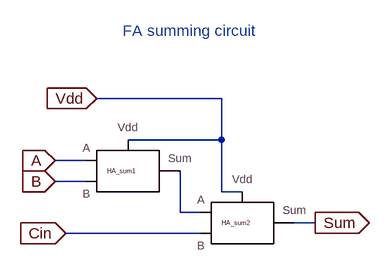
[diagram p0: schematic fa_sum.asc]
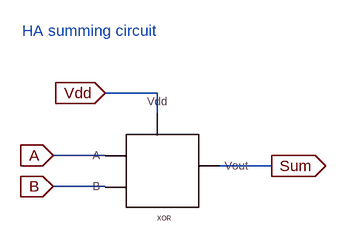
[diagram p1: sub-circuit ha_sum.asc]
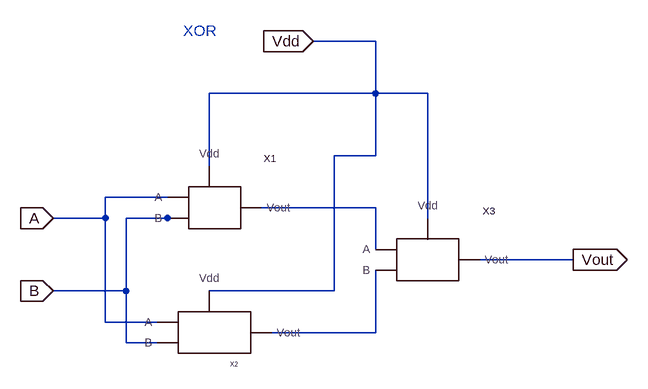
[diagram p2: sub-circuit my_xor.asc]
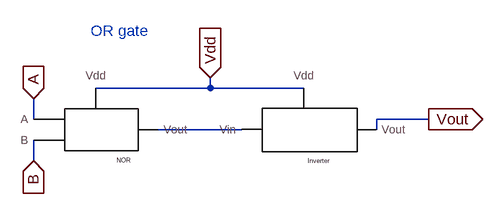
[diagram p3: sub-circuit my_or.asc]
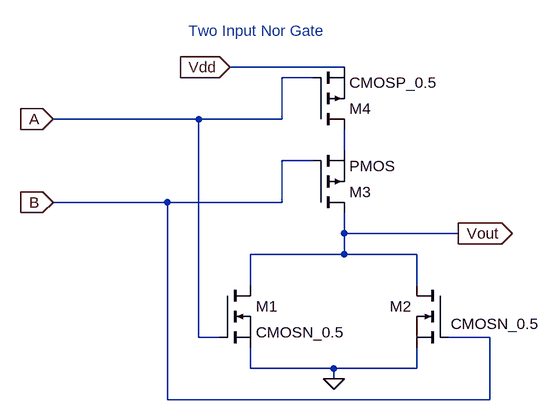
[diagram p4: sub-circuit my_nor.asc]
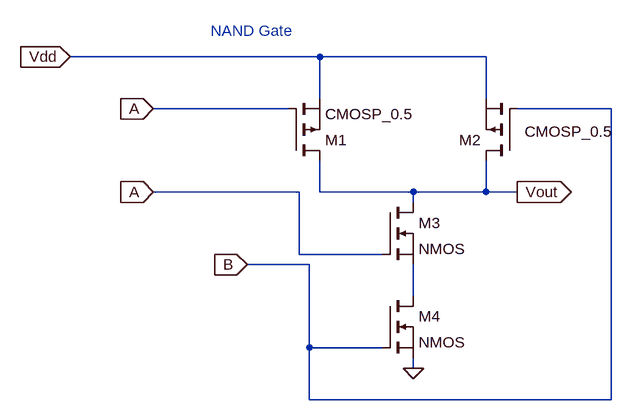
[diagram p5: sub-circuit my_nand.asc]
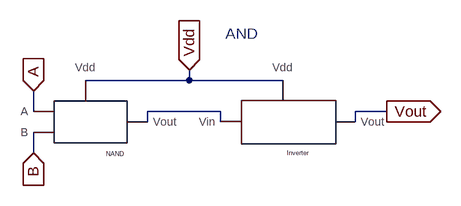
[diagram p6: sub-circuit my_and.asc]
fa_sum.asc, the LTspice schematic file:
Version 4
SHEET 1 880 680
WIRE 320 32 128 32
WIRE 320 96 320 32
WIRE 320 96 176 96
WIRE 112 128 64 128
WIRE 112 160 64 160
WIRE 320 176 320 96
WIRE 352 176 320 176
WIRE 256 208 256 144
WIRE 288 208 256 208
WIRE 464 224 432 224
WIRE 288 240 80 240
FLAG 64 128 A
IOPIN 64 128 In
FLAG 64 160 B
IOPIN 64 160 In
FLAG 80 240 Cin
IOPIN 80 240 In
FLAG 464 224 Sum
IOPIN 464 224 Out
FLAG 128 32 Vdd
IOPIN 128 32 In
SYMBOL ha_sum 176 144 R0
SYMATTR InstName HA_sum1
SYMBOL ha_sum 352 224 R0
SYMATTR InstName HA_sum2
TEXT 168 -72 Left 2 ;FA summing circuit

ha_sum.asc, the sub-circuit schematic file:
Version 4
SHEET 1 880 680
WIRE 208 0 128 0
WIRE 208 32 208 0
WIRE 128 96 48 96
WIRE 384 112 304 112
WIRE 128 144 48 144
FLAG 48 96 A
IOPIN 48 96 In
FLAG 48 144 B
IOPIN 48 144 In
FLAG 128 0 Vdd
IOPIN 128 0 In
FLAG 384 112 Sum
IOPIN 384 112 Out
SYMBOL my_xor 208 112 R0
SYMATTR InstName XOR
TEXT 0 -96 Left 2 ;HA summing circuit

my_xor.asc, the sub-circuit schematic file:
Version 4
SHEET 1 1232 680
WIRE 592 -160 496 -160
WIRE 592 -80 592 -160
WIRE 592 -80 336 -80
WIRE 672 -80 592 -80
WIRE 592 16 592 -80
WIRE 592 16 528 16
WIRE 336 32 336 -80
WIRE 272 80 176 80
WIRE 592 96 416 96
WIRE 176 112 176 80
WIRE 176 112 96 112
WIRE 272 112 208 112
WIRE 288 112 272 112
WIRE 672 112 672 -80
WIRE 592 160 592 96
WIRE 896 176 752 176
WIRE 208 224 208 112
WIRE 208 224 96 224
WIRE 528 224 528 16
WIRE 528 224 336 224
WIRE 176 272 176 112
WIRE 256 272 176 272
WIRE 592 288 592 192
WIRE 592 288 432 288
WIRE 208 304 208 224
WIRE 256 304 208 304
FLAG 96 112 A
IOPIN 96 112 In
FLAG 96 224 B
IOPIN 96 224 In
FLAG 496 -160 Vdd
IOPIN 496 -160 In
FLAG 896 176 Vout
IOPIN 896 176 Out
SYMBOL my_or 336 80 R0
SYMATTR InstName X1
SYMBOL my_nand 336 288 R0
SYMATTR InstName X2
SYMBOL my_and 672 176 R0
SYMATTR InstName X3
TEXT 296 -176 Left 2 ;XOR

my_or.asc, the sub-circuit schematic file:
Version 4
SHEET 1 880 680
WIRE 288 144 288 128
WIRE 288 144 112 144
WIRE 432 144 288 144
WIRE 16 192 16 160
WIRE 624 192 544 192
WIRE 336 208 208 208
WIRE 544 208 544 192
WIRE 16 256 16 224
FLAG 16 160 A
IOPIN 16 160 In
FLAG 16 256 B
IOPIN 16 256 In
FLAG 288 128 Vdd
IOPIN 288 128 In
FLAG 624 192 Vout
IOPIN 624 192 Out
SYMBOL my_nor 112 208 R0
SYMATTR InstName NOR
SYMBOL my_inverter 432 208 R0
SYMATTR InstName Inverter
TEXT 104 56 Left 2 ;OR gate

my_nor.asc, the sub-circuit schematic file:
Version 4
SHEET 1 880 680
WIRE 336 -240 160 -240
WIRE 288 -224 240 -224
WIRE 112 -160 -112 -160
WIRE 240 -160 240 -224
WIRE 240 -160 112 -160
WIRE 336 -112 336 -144
WIRE 288 -96 240 -96
WIRE 64 -32 -112 -32
WIRE 240 -32 240 -96
WIRE 240 -32 64 -32
WIRE 336 16 336 -16
WIRE 512 16 336 16
WIRE 336 48 336 16
WIRE 336 48 192 48
WIRE 448 48 336 48
WIRE 192 96 192 48
WIRE 448 96 448 48
WIRE 112 176 112 -160
WIRE 144 176 112 176
WIRE 560 176 496 176
WIRE 192 224 192 192
WIRE 320 224 192 224
WIRE 448 224 448 192
WIRE 448 224 320 224
WIRE 320 240 320 224
WIRE 64 272 64 -32
WIRE 560 272 560 176
WIRE 560 272 64 272
FLAG -112 -32 B
IOPIN -112 -32 In
FLAG -112 -160 A
IOPIN -112 -160 In
FLAG 160 -240 Vdd
IOPIN 160 -240 In
FLAG 512 16 Vout
IOPIN 512 16 Out
FLAG 320 240 0
SYMBOL nmos 144 96 R0
SYMATTR InstName M1
SYMATTR Value CMOSN_0.5
SYMBOL nmos 496 96 M0
WINDOW 3 -141 59 Left 2
SYMATTR Value CMOSN_0.5
SYMATTR InstName M2
SYMBOL pmos 288 -144 M180
SYMATTR InstName M4
SYMATTR Value CMOSP_0.5
SYMBOL pmos 288 -16 M180
SYMATTR InstName M3
TEXT 96 -296 Left 2 ;Two Input Nor Gate

my_nand.asc, the sub-circuit schematic file:
Version 4
SHEET 1 932 680
WIRE 480 -16 96 -16
WIRE 736 -16 480 -16
WIRE 480 48 480 -16
WIRE 736 48 736 -16
WIRE 432 64 224 64
WIRE 928 64 784 64
WIRE 448 192 224 192
WIRE 480 192 480 144
WIRE 624 192 480 192
WIRE 736 192 736 144
WIRE 736 192 624 192
WIRE 784 192 736 192
WIRE 624 208 624 192
WIRE 448 288 448 192
WIRE 576 288 448 288
WIRE 464 304 368 304
WIRE 624 352 624 304
WIRE 464 432 464 304
WIRE 576 432 464 432
WIRE 624 464 624 448
WIRE 464 512 464 432
WIRE 928 512 928 64
WIRE 928 512 464 512
FLAG 624 464 0
FLAG 96 -16 Vdd
IOPIN 96 -16 In
FLAG 224 64 A
IOPIN 224 64 In
FLAG 224 192 A
IOPIN 224 192 In
FLAG 368 304 B
IOPIN 368 304 In
FLAG 784 192 Vout
IOPIN 784 192 Out
SYMBOL pmos 432 144 M180
SYMATTR InstName M1
SYMATTR Value CMOSP_0.5
SYMBOL pmos 784 144 R180
WINDOW 3 -11 45 Right 2
SYMATTR Value CMOSP_0.5
SYMATTR InstName M2
SYMBOL nmos 576 208 R0
SYMATTR InstName M3
SYMBOL nmos 576 352 R0
SYMATTR InstName M4
TEXT 312 -56 Left 2 ;NAND Gate

my_and.asc, the sub-circuit schematic file:
Version 4
SHEET 1 880 680
WIRE 288 112 288 96
WIRE 288 112 128 112
WIRE 432 112 288 112
WIRE 48 160 48 128
WIRE 336 160 224 160
WIRE 592 160 544 160
WIRE 224 176 224 160
WIRE 336 176 336 160
WIRE 544 176 544 160
WIRE 48 224 48 192
FLAG 48 128 A
IOPIN 48 128 In
FLAG 48 224 B
IOPIN 48 224 In
FLAG 288 96 Vdd
IOPIN 288 96 In
FLAG 592 160 Vout
IOPIN 592 160 Out
SYMBOL my_nand 128 176 R0
SYMATTR InstName NAND
SYMBOL my_inverter 432 176 R0
SYMATTR InstName Inverter
TEXT 344 40 Left 2 ;AND

The netlist it stands for:
* fa_sum.asc
XHA_sum1 A B N001 Vdd ha_sum
XHA_sum2 N001 Cin Sum Vdd ha_sum

* block symbol definitions
.subckt ha_sum A B Sum Vdd
XXOR A B Vdd Sum my_xor
* HA summing circuit
.ends ha_sum

.subckt my_xor A B Vdd Vout
XX1 A B Vdd N001 my_or
XX2 A B N002 Vdd my_nand
XX3 N001 N002 Vout Vdd my_and
* XOR
.ends my_xor

.subckt my_or A B Vdd Vout
XNOR A B N001 Vdd my_nor
XInverter N001 Vdd Vout my_inverter  ; pins Vin Vdd Vout
* OR gate
.ends my_or

.subckt my_nor A B Vout Vdd
M1 Vout A 0 0 CMOSN_0.5
M2 Vout B 0 0 CMOSN_0.5
M4 N001 A Vdd Vdd CMOSP_0.5
M3 Vout B N001 N001 PMOS
* Two Input Nor Gate
.ends my_nor

.subckt my_nand A B Vout Vdd
M1 Vout A Vdd Vdd CMOSP_0.5
M2 Vout B Vdd Vdd CMOSP_0.5
M3 Vout A N001 N001 NMOS
M4 N001 B 0 0 NMOS
* NAND Gate
.ends my_nand

.subckt my_and A B Vout Vdd
XNAND A B N001 Vdd my_nand
XInverter N001 Vdd Vout my_inverter  ; pins Vin Vdd Vout
* AND
.ends my_and

.model NMOS NMOS
.model PMOS PMOS
.lib standard.mos
* FA summing circuit
.backanno
.end